# Altium schematic sheet RTC.SchDoc
size A4
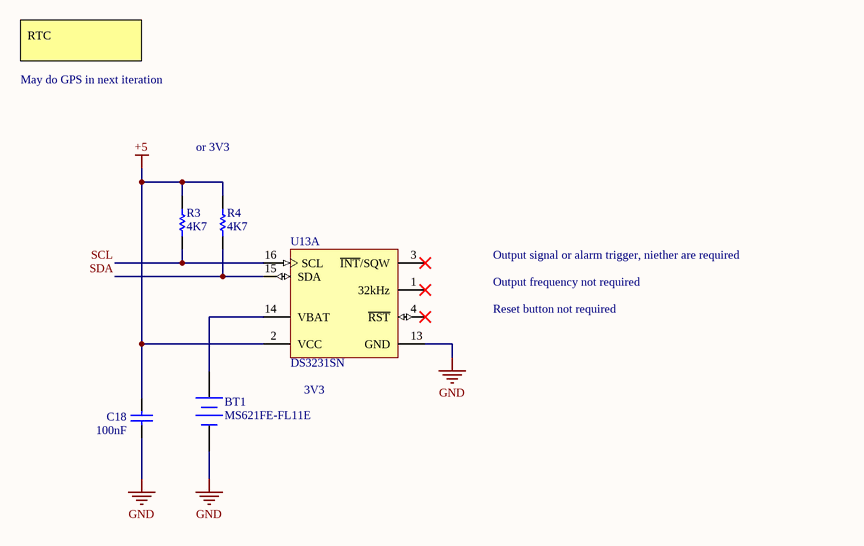
[diagram p0: RTC.SchDoc]

## Parts
BT1  MS621FE-FL11E  [SEIK-MS621FE-FL11E-2_V]
C18  100nF  [CAPC0603(1608)100_M]
R3  4K7  [RESC0603(1608)_N]
R4  4K7  [RESC0603(1608)_N]
U13  DS3231SN  [W16-H2_L]  (part A of 2)

## Nets
+5: C18.2 R3.1 R4.2 U13.2(VCC)
GND: BT1.2(-) C18.1 U13.13(GND)
SCL: R3.2 U13.16(SCL)
SDA: R4.1 U13.15(SDA)
NetBT1_1: BT1.1(+) U13.14(VBAT)

Not connected (* = marked no-connect by the designer): U13 1(32kHz)* 3(~{INT}/SQW)* 4(~{RST})*

## Notes on the sheet
- RTC
- May do GPS in next iteration
- or 3V3
- Output signal or alarm trigger, niether are required
- Output frequency not required
- Reset button not required
- (near U13) 3V3

## Library data of the parts
BT1 = CMP-2000-05342-1: MS Lihium Rechargeable Battery, 3 V, -20 to 60 degC, Tray; Manufacturer: SeikoInstruments; Brand: SeikoInstrumentsMicroEnergy; Output Voltage: 3V; Capacity: 5.5mAh; Chemistry: Lithium; Battery Size: 621; Unit Weight: 0.008113oz; Datasheet URL: http://datasheet.octopart.com/MS621FE-FL11E-Seiko-datasheet-5320152.pdf; Rechargeable/Non-Rechargeable: Rechargeable; Orientation: Vertical; Height: 2.1mm; Series: MS; Datasheet Version: Jan-08; Type: CoinCellBatterywithLeads; Diameter: 6.8mm; Mounting Style: WithLeads; Product Category: CoinCellBattery; Termination Style: ThroughHole; Packaging: Tray; Manufacturer URL: http://www.sii.co.jp/en/; RoHS: NotApplicable; Factory Pack Quantity: 100
C18 = CMP-1035-02583-1: CAP 100nF 16V ±5% 0603 (1608 Metric) Thickness 1mm SMD; Tolerance: Â±5%; Case-Metric: 1608; Case-EIA: 0603; Rated Voltage: 16 V; Max Thickness: 1 mm; Technology: SMT; Value: 100nF
R3 R4 = CMP-1012-00090-1: 4K7 0.1W 5% 0603 (1608 Metric)  SMD; Case-Metric: 1608; Value: 4700.00 Ohm; Case-EIA: 0603; Tolerance: 5 %; Technology: SMT; Power: 0.1 W
U13 = CMP-0254-00293-1: Extremely Accurate I2C-Integrated Real-Time Clock/TCXO/Crystal, 16-Pin SO, -40 to 85 degC; ComponentLink1Description: Manufacturer URL; ComponentLink3URL: http://pdfserv.maxim-ic.com/package_dwgs/21-0042.PDF; ComponentLink3Description: Package Specification; PackageVersion: revD, 2010; ComponentLink2URL: http://datasheets.maxim-ic.com/en/ds/DS3231.pdf; ComponentLink2Description: Datasheet; PackageReference: W16-H2; Code_JEDEC: MS-013-AA; ComponentLink1URL: http://www.maxim-ic.com; PackageDescription: 16-Pin Small-Outline IC, Wide (0.3in), 1.27 mm Pitch, SOIC (W); Code_IPC: SOIC127P1030-16; DatasheetVersion: Rev 8, Jul-2010